# EAGLE schematic BluetoothBoard (EAGLE 7.6.0)
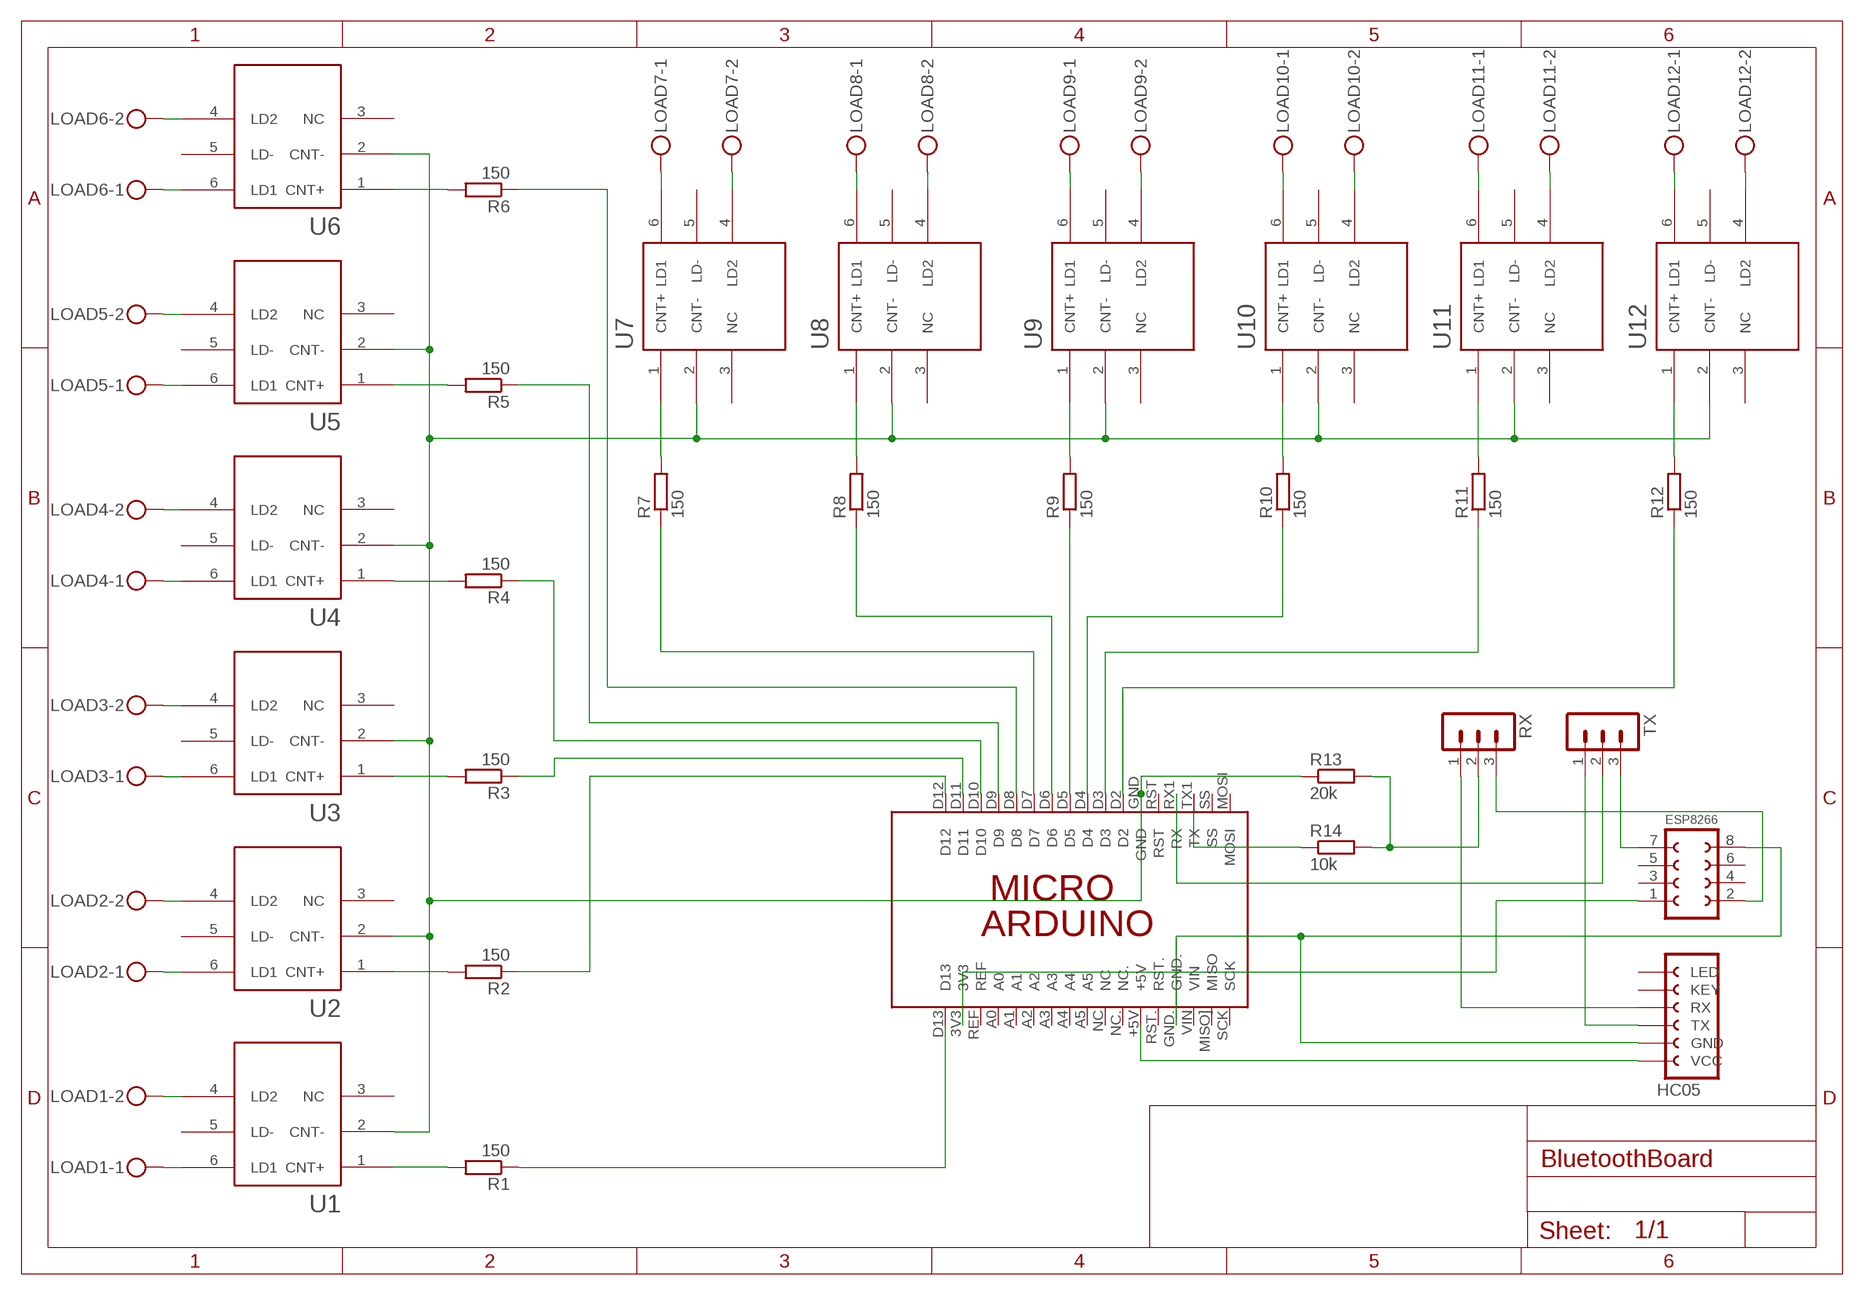
[diagram p0: schematic, sheet 1]

## Parts
ESP8266  ESP8266  [ESP8266]
HC05  FE06-1  [FE06]
LOAD1  MKDSN1,5/2-5,08  [MKDSN1,5/2-5,08]
LOAD2  MKDSN1,5/2-5,08  [MKDSN1,5/2-5,08]
LOAD3  MKDSN1,5/2-5,08  [MKDSN1,5/2-5,08]
LOAD4  MKDSN1,5/2-5,08  [MKDSN1,5/2-5,08]
LOAD5  MKDSN1,5/2-5,08  [MKDSN1,5/2-5,08]
LOAD6  MKDSN1,5/2-5,08  [MKDSN1,5/2-5,08]
LOAD7  MKDSN1,5/2-5,08  [MKDSN1,5/2-5,08]
LOAD8  MKDSN1,5/2-5,08  [MKDSN1,5/2-5,08]
LOAD9  MKDSN1,5/2-5,08  [MKDSN1,5/2-5,08]
LOAD10  MKDSN1,5/2-5,08  [MKDSN1,5/2-5,08]
LOAD11  MKDSN1,5/2-5,08  [MKDSN1,5/2-5,08]
LOAD12  MKDSN1,5/2-5,08  [MKDSN1,5/2-5,08]
R1  150  R-EU_0207/7  [0207/7]
R2  150  R-EU_0207/7  [0207/7]
R3  150  R-EU_0207/7  [0207/7]
R4  150  R-EU_0207/7  [0207/7]
R5  150  R-EU_0207/7  [0207/7]
R6  150  R-EU_0207/7  [0207/7]
R7  150  R-EU_0207/7  [0207/7]
R8  150  R-EU_0207/7  [0207/7]
R9  150  R-EU_0207/7  [0207/7]
R10  150  R-EU_0207/7  [0207/7]
R11  150  R-EU_0207/7  [0207/7]
R12  150  R-EU_0207/7  [0207/7]
R13  20k  R-EU_0207/7  [0207/7]
R14  10k  R-EU_0207/7  [0207/7]
RX  MA03-1  [MA03-1]
TX  MA03-1  [MA03-1]
U1  LCA710  [DIL-06]
U2  LCA710  [DIL-06]
U3  LCA710  [DIL-06]
U4  LCA710  [DIL-06]
U5  LCA710  [DIL-06]
U6  LCA710  [DIL-06]
U7  LCA710  [DIL-06]
U8  LCA710  [DIL-06]
U9  LCA710  [DIL-06]
U10  LCA710  [DIL-06]
U11  LCA710  [DIL-06]
U12  LCA710  [DIL-06]
UC  ARDUINO_MICRO  [ARDUINO_MICRO]

## Nets
GND: R13.1 U1.2(CNT-) U2.2(CNT-) U3.2(CNT-) U4.2(CNT-) U5.2(CNT-) U6.2(CNT-) U7.2(CNT-) U8.2(CNT-) U9.2(CNT-) U10.2(CNT-) U11.2(CNT-) U12.2(CNT-) UC.GND
N$1: R1.2 U1.1(CNT+)
N$2: LOAD1.2 U1.4(LD2)
N$3: LOAD1.1 U1.6(LD1)
N$4: R2.2 U2.1(CNT+)
N$5: LOAD2.1 U2.6(LD1)
N$6: LOAD2.2 U2.4(LD2)
N$7: R3.2 U3.1(CNT+)
N$8: LOAD3.1 U3.6(LD1)
N$9: LOAD3.2 U3.4(LD2)
N$10: R4.2 U4.1(CNT+)
N$11: LOAD4.1 U4.6(LD1)
N$12: LOAD4.2 U4.4(LD2)
N$13: R5.2 U5.1(CNT+)
N$14: LOAD5.1 U5.6(LD1)
N$15: LOAD5.2 U5.4(LD2)
N$16: R6.2 U6.1(CNT+)
N$17: LOAD6.1 U6.6(LD1)
N$18: LOAD6.2 U6.4(LD2)
N$19: TX.2 UC.RX1(RX)
N$20: ESP8266.1 UC.3V3
N$21: R14.1 UC.TX1(TX)
N$22: ESP8266.2 RX.3
N$23: R7.2 U7.1(CNT+)
N$24: LOAD7.1 U7.6(LD1)
N$25: LOAD7.2 U7.4(LD2)
N$26: R13.2 R14.2 RX.2
N$27: R8.2 U8.1(CNT+)
N$28: LOAD8.1 U8.6(LD1)
N$29: HC05.6(VCC) UC.+5V
N$30: HC05.3(RX) RX.1
N$31: LOAD8.2 U8.4(LD2)
N$32: ESP8266.7(TX) TX.3
N$33: HC05.4(TX) TX.1
N$34: R9.2 U9.1(CNT+)
N$35: LOAD9.1 U9.6(LD1)
N$36: LOAD9.2 U9.4(LD2)
N$37: R10.2 U10.1(CNT+)
N$38: LOAD10.1 U10.6(LD1)
N$39: LOAD10.2 U10.4(LD2)
N$40: R11.2 U11.1(CNT+)
N$41: LOAD11.1 U11.6(LD1)
N$42: LOAD11.2 U11.4(LD2)
N$43: R12.2 U12.1(CNT+)
N$44: LOAD12.1 U12.6(LD1)
N$45: LOAD12.2 U12.4(LD2)
N$47: ESP8266.8 HC05.5(GND) UC.GND.
N$49: R12.1 UC.D2
N$50: R11.1 UC.D3
N$51: R10.1 UC.D4
N$52: R9.1 UC.D5
N$53: R8.1 UC.D6
N$54: R7.1 UC.D7
N$55: R6.1 UC.D8
N$56: R5.1 UC.D9
N$57: R4.1 UC.D10
N$58: R3.1 UC.D11
N$59: R1.1 UC.D13
N$60: R2.1 UC.D12
Unconnected: ESP8266.3 ESP8266.4 ESP8266.5 ESP8266.6 HC05.1(LED) HC05.2(KEY) U1.3(NC) U1.5(LD-) U2.3(NC) U2.5(LD-) U3.3(NC) U3.5(LD-) U4.3(NC) U4.5(LD-) U5.3(NC) U5.5(LD-) U6.3(NC) U6.5(LD-) U7.3(NC) U7.5(LD-) U8.3(NC) U8.5(LD-) U9.3(NC) U9.5(LD-) U10.3(NC) U10.5(LD-) U11.3(NC) U11.5(LD-) U12.3(NC) U12.5(LD-) UC.A0 UC.A1 UC.A2 UC.A3 UC.A4 UC.A5 UC.MISO](MISO) UC.MOSI UC.NC UC.NC. UC.REF UC.RST UC.RST. UC.SCK UC.SS UC.VIN

## Library data of the parts
ESP8266 = ESP8266:ESP8266
HC05 = con-lsta:FE06-1: FEMALE HEADER; OC_FARNELL: unknown; OC_NEWARK: unknown
LOAD1-LOAD12 = con-phoenix-508:MKDSN1,5/2-5,08: MKDSN 1,5/ 2-5,08 Printklemme Nennstrom: 13,5 A Nennspannung: 250 V Rastermaß: 5,08 mm Polzahl: 2 Anschlussart: Schraubanschluss Montage: Löten Anschlussrichtung Leiter/Platine: 0 ° Artikelnummer: 1729128 Source: http://eshop.phoenixcontact.com .. 1729128.pdf
R1-R14 = resistor:R-EU_: RESISTOR, European symbol
RX TX = con-lstb:MA03-1: PIN HEADER; OC_FARNELL: unknown; OC_NEWARK: unknown
U1-U12 = LCA710:LCA710
UC = E14_Arduino_revB:ARDUINO_MICRO: Device for representing an Arduino Micro board with a footprint in an EAGLE design. Created by Dave Young for Element14. More EAGLE documentation at: http://www.element14.com/community/community/knode/cadsoft_eagle